# EAGLE design Link232-wifi-c64 (EAGLE 9.6.2)
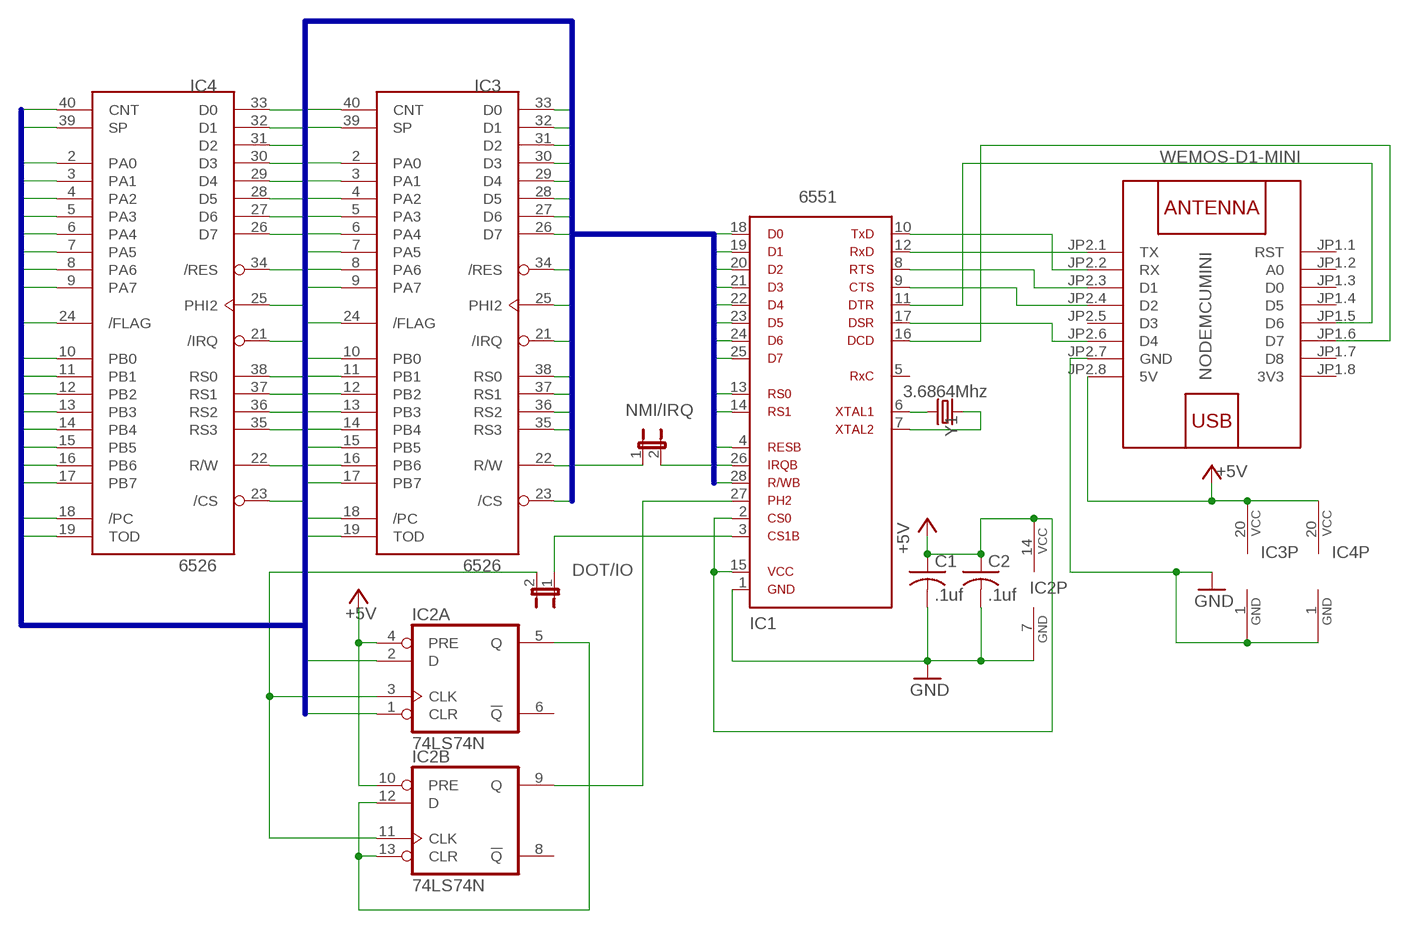
[diagram p0: schematic, sheet 1]

## Parts
C1  .1uf  C-US050-024X044  [C050-024X044]
C2  .1uf  C-US050-024X044  [C050-024X044]
IC1  6551  [6551]
IC2  74LS74N  [DIL14]
IC3  6526  [DIP40]
IC4  6526  [DIP40]
JP1  NMI/IRQ  JP1E  [JP1]
JP2  DOT/IO  JP1E  [JP1]
NODEMCUMINI  WEMOS-D1-MINI  [WEMOS-D1-MINI]
Y1  3.6864Mhz  CRYSTALPTH-HC49US  [HC49US]

## Nets
+5V: C1.1 C2.1 IC1.2 IC1.15 IC2.4(A:PRE) IC2.10(B:PRE) IC2.14(P:VCC) IC3.20(VCC) IC4.20(VCC) NODEMCUMINI.JP2.8(5V)
/CS: IC3.23(/CS) IC4.23(/CS)
/FLAG: IC3.24(/FLAG) IC4.24(/FLAG)
/PC: IC3.18(/PC) IC4.18(/PC)
CNT: IC3.40(CNT) IC4.40(CNT)
D0: IC1.18 IC3.33(D0) IC4.33(D0)
D1: IC1.19 IC3.32(D1) IC4.32(D1)
D2: IC1.20 IC3.31(D2) IC4.31(D2)
D3: IC1.21 IC3.30(D3) IC4.30(D3)
D4: IC1.22 IC3.29(D4) IC4.29(D4)
D5: IC1.23 IC3.28(D5) IC4.28(D5)
D6: IC1.24 IC3.27(D6) IC4.27(D6)
D7: IC1.25 IC3.26(D7) IC4.26(D7)
GND: C1.2 C2.2 IC1.1 IC2.7(P:GND) IC3.1(GND) IC4.1(GND) NODEMCUMINI.JP2.7(GND)
IRQ: IC3.21(/IRQ) IC4.21(/IRQ) JP1.1
N$1: IC2.3(A:CLK) IC2.11(B:CLK) JP2.2
N$2: IC2.5(A:Q) IC2.12(B:D) IC2.13(B:CLR)
N$3: IC1.27 IC2.9(B:Q)
N$4: IC1.26 JP1.2
N$5: IC1.3 JP2.1
N$9: IC1.6 Y1.2
N$10: IC1.7 Y1.1
N$11: IC1.12 NODEMCUMINI.JP2.1(TX)
N$12: IC1.10 NODEMCUMINI.JP2.2(RX)
N$13: IC1.8 NODEMCUMINI.JP2.3(D1)
N$14: IC1.9 NODEMCUMINI.JP2.4(D2)
N$15: IC1.17 NODEMCUMINI.JP2.6(D4)
N$16: IC1.11 NODEMCUMINI.JP1.5(D6)
N$17: IC1.16 NODEMCUMINI.JP1.6(D7)
PA0: IC3.2(PA0) IC4.2(PA0)
PA1: IC3.3(PA1) IC4.3(PA1)
PA2: IC3.4(PA2) IC4.4(PA2)
PA3: IC3.5(PA3) IC4.5(PA3)
PA4: IC3.6(PA4) IC4.6(PA4)
PA5: IC3.7(PA5) IC4.7(PA5)
PA6: IC3.8(PA6) IC4.8(PA6)
PA7: IC3.9(PA7) IC4.9(PA7)
PB0: IC3.10(PB0) IC4.10(PB0)
PB1: IC3.11(PB1) IC4.11(PB1)
PB2: IC3.12(PB2) IC4.12(PB2)
PB3: IC3.13(PB3) IC4.13(PB3)
PB4: IC3.14(PB4) IC4.14(PB4)
PB5: IC3.15(PB5) IC4.15(PB5)
PB6: IC3.16(PB6) IC4.16(PB6)
PB7: IC3.17(PB7) IC4.17(PB7)
PHI2: IC2.1(A:CLR) IC2.2(A:D) IC3.25(PHI2) IC4.25(PHI2)
RES: IC1.4 IC3.34(/RES) IC4.34(/RES)
RS0: IC1.13 IC3.38(RS0) IC4.38(RS0)
RS1: IC1.14 IC3.37(RS1) IC4.37(RS1)
RS2: IC3.36(RS2) IC4.36(RS2)
RS3: IC3.35(RS3) IC4.35(RS3)
RW: IC1.28 IC3.22(R/W) IC4.22(R/W)
SP: IC3.39(SP) IC4.39(SP)
TOD: IC3.19(TOD) IC4.19(TOD)
Unconnected: IC1.5 IC2.6(A:!Q) IC2.8(B:!Q) NODEMCUMINI.JP1.1(RST) NODEMCUMINI.JP1.2(A0) NODEMCUMINI.JP1.3(D0) NODEMCUMINI.JP1.4(D5) NODEMCUMINI.JP1.7(D8) NODEMCUMINI.JP2.5(D3)

## Buses
CNT,/CS,D0,D1,D2,D3,D4,D5,D6,D7,/FLAG,IRQ,PA0,PA1,PA2,PA3,PA4,PA5,PA6,PA7,PB0,PB1,PB2,PB3,PB4,PB5,PB6,PB7,/PC,PHI2,RES,RS0,RS1,RS2,RS3,RW,SP,TOD

## Power pins joined to a net without a drawn wire
3V3: NODEMCUMINI.JP1.8(3V3)

## Library data of the parts
C1 C2 = rcl:C-US: CAPACITOR, American symbol; SPICEPREFIX: C
IC1 = 65xx:6551: Dual In Line
IC2 = 74xx-us:74*74: Dual D type positive edge triggered FLIP FLOP, preset and clear
IC3 IC4 = 0RB_65xx:6526: I/O device: two 8-bits ports, handshake lines, timers. Used in C64 and C128.
JP1 JP2 = jumper:JP1E: JUMPER
NODEMCUMINI = diy-modules:WEMOS-D1-MINI: WEMOS D1 mini: Mini Wi-Fi Board based on ESP-8266 device More details can be found here: https://www.wemos.cc/product/d1-mini.html Click here to find device on ebay.com <http://www.ebay.com/sch/wemos+d1+mini+nodemcu>
Y1 = SparkFun-Clocks:CRYSTAL: Crystals (Generic) These are passive quartz crystals, which can be used as a clock source for a microcontroller. Crystal's are two-terminal devices. They require external "load" capacitors to generate an oscillating signal.

## Board
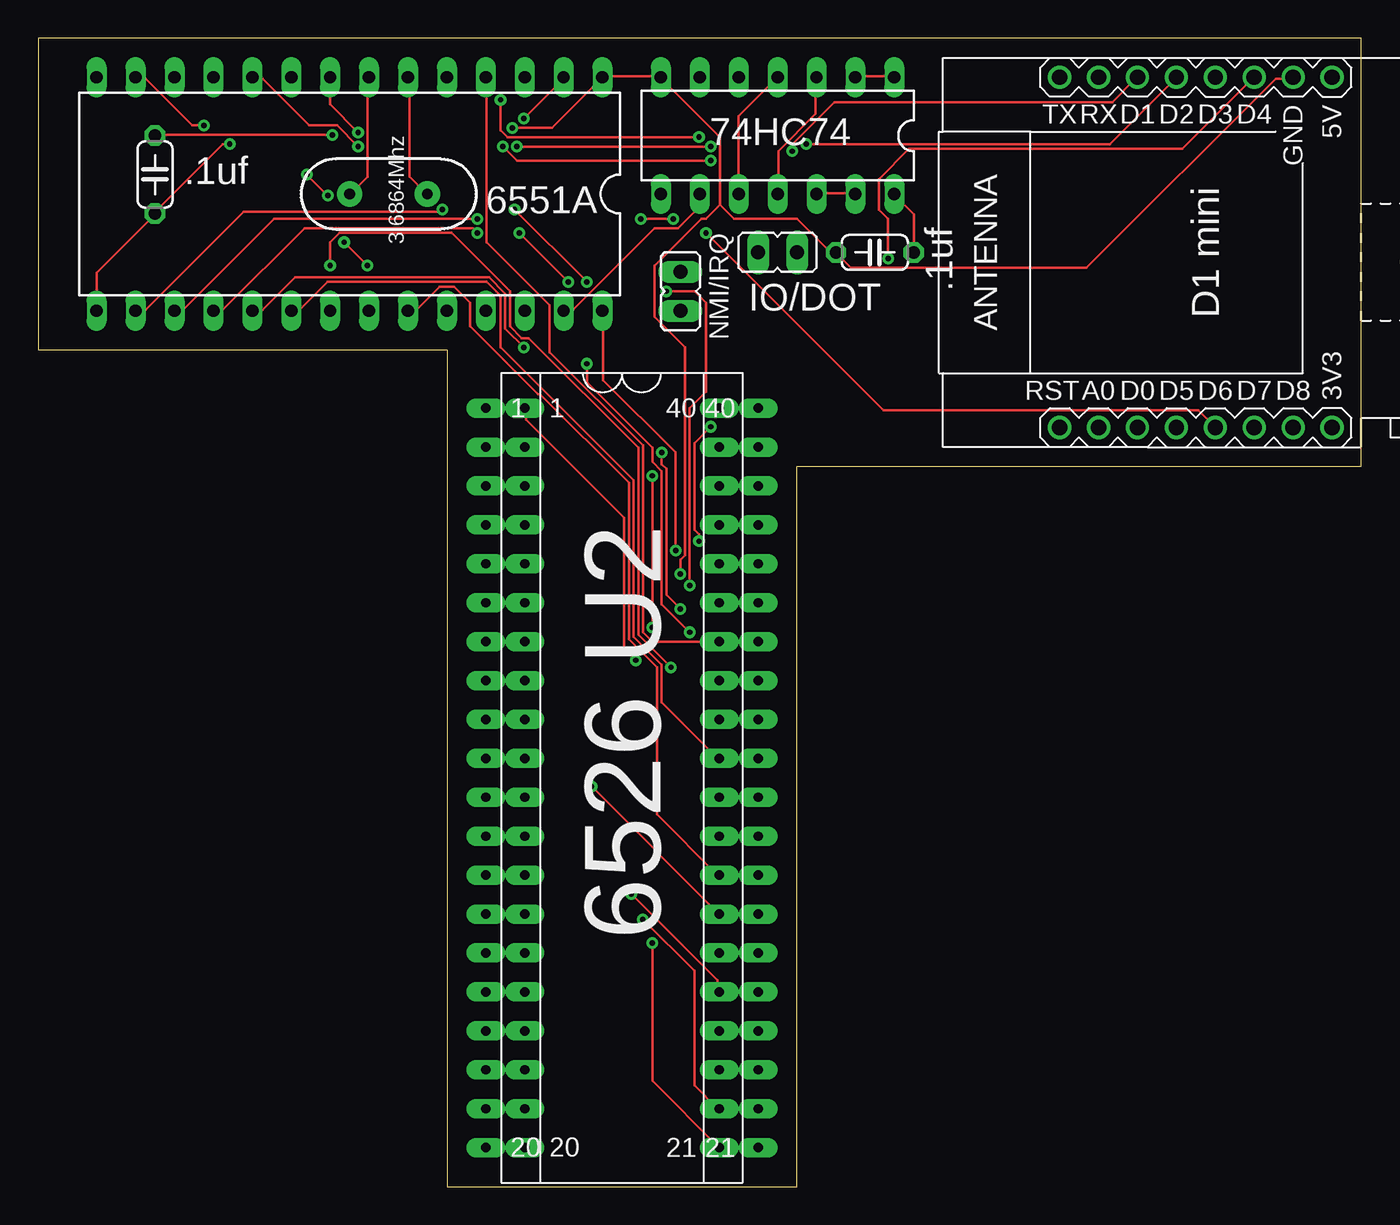
[diagram p1: board, top side]
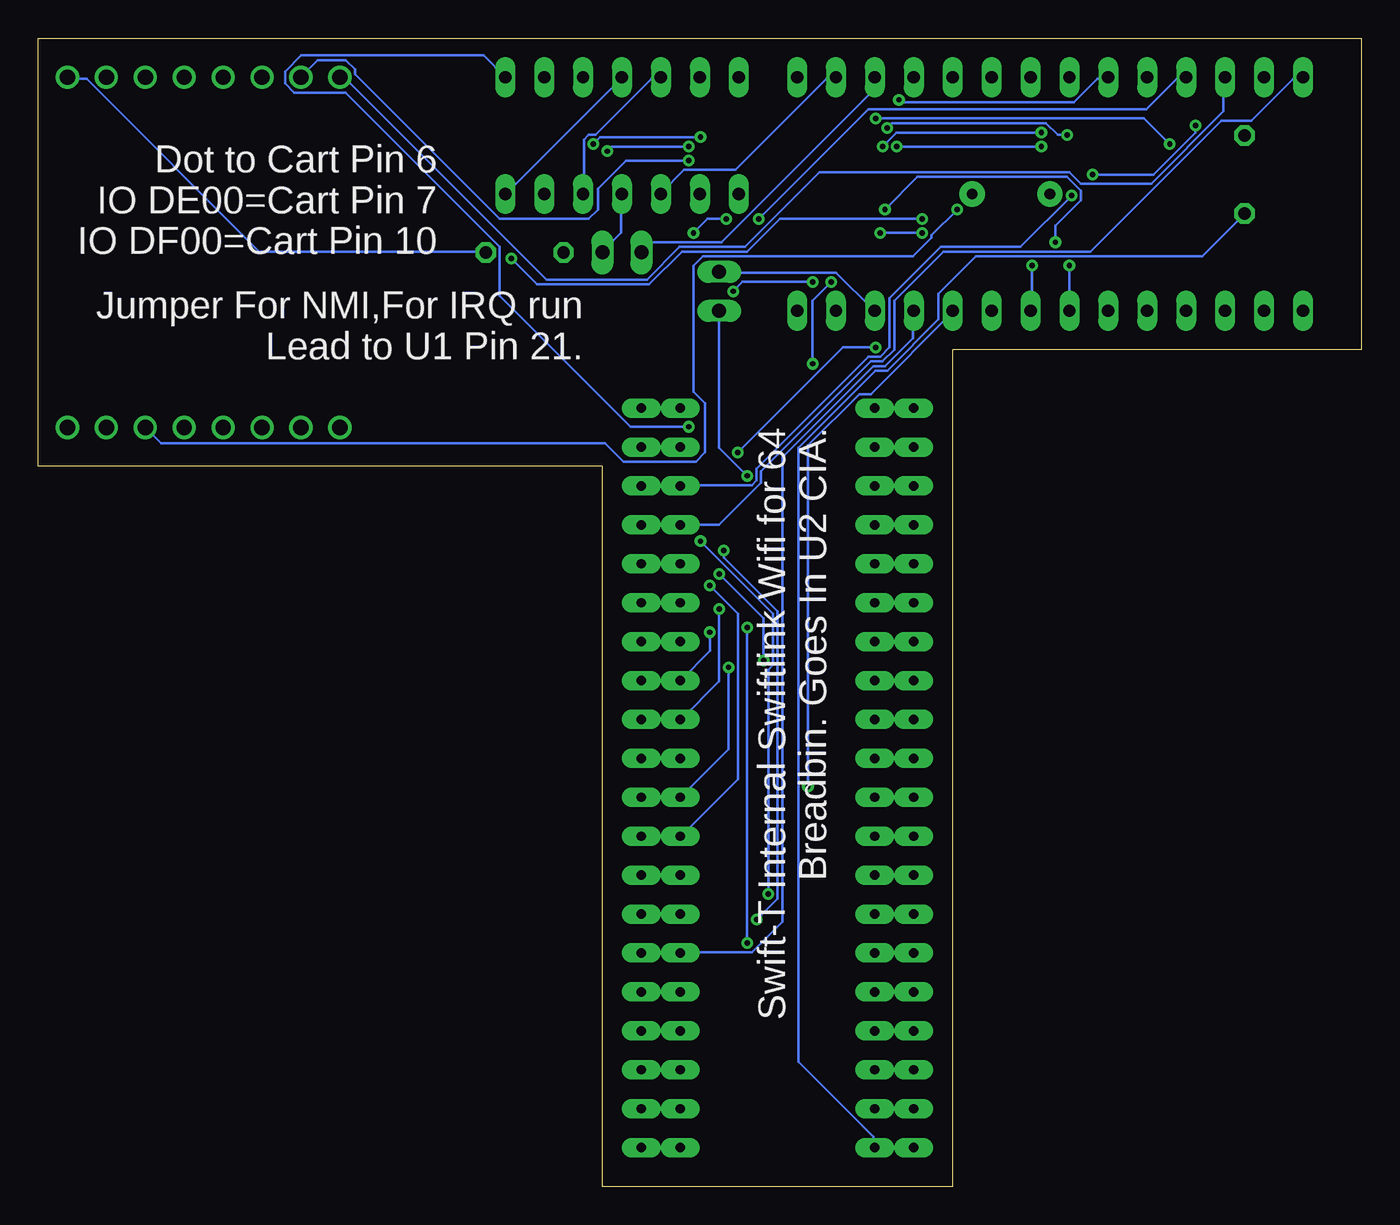
[diagram p2: board, bottom side, seen from below]

Size 86.36 x 74.93 mm. Coordinates in mm from the lower left corner, seen from the top.
Outline: 26.67,0 49.53,0 49.53,46.99 86.36,46.99 86.36,74.93 0,74.93 0,54.61 26.67,54.61 26.67,0
Copper layers (1*16): Top 0.035mm / dielectric 1.5mm / Bottom 0.035mm
Design rules "default": minimum track width 6mil, minimum drill 0.35mm, track to track 6mil, track to pad 6mil, pad to pad 6mil, via to via 6mil, smd to smd 6mil, copper to edge 40mil, drill to drill 6mil, minimum pad ring 10mil, minimum via ring 8mil, stop-mask expansion 4mil, vias tented up to drill 0mil, thermal gap 10mil

### Footprints (pad centres in the part's own frame; a part is rotated, then mirrored left to right if it is on the bottom)
C050-024X044 = drill 0.813 octagon: 1 -2.54,0; 2 2.54,0
6551 = drill 0.813 long: 1 -16.51,-7.62; 2 -13.97,-7.62; 3 -11.43,-7.62; 4 -8.89,-7.62; 5 -6.35,-7.62; 6 -3.81,-7.62; 7 -1.27,-7.62; 8 1.27,-7.62; 9 3.81,-7.62; 10 6.35,-7.62; 11 8.89,-7.62; 12 11.43,-7.62; 13 13.97,-7.62; 14 16.51,-7.62; 15 16.51,7.62; 16 13.97,7.62; 17 11.43,7.62; 18 8.89,7.62; 19 6.35,7.62; 20 3.81,7.62; 21 1.27,7.62; 22 -1.27,7.62; 23 -3.81,7.62; 24 -6.35,7.62; 25 -8.89,7.62; 26 -11.43,7.62; 27 -13.97,7.62; 28 -16.51,7.62
DIL14 = drill 0.813 long: 1 -7.62,-3.81; 2 -5.08,-3.81; 3 -2.54,-3.81; 4 0,-3.81; 5 2.54,-3.81; 6 5.08,-3.81; 7 7.62,-3.81; 8 7.62,3.81; 9 5.08,3.81; 10 2.54,3.81; 11 0,3.81; 12 -2.54,3.81; 13 -5.08,3.81; 14 -7.62,3.81
DIP40 = drill 0.61 pad 1.27 long: 1 -24.13,-7.62; 2 -21.59,-7.62; 3 -19.05,-7.62; 4 -16.51,-7.62; 5 -13.97,-7.62; 6 -11.43,-7.62; 7 -8.89,-7.62; 8 -6.35,-7.62; 9 -3.81,-7.62; 10 -1.27,-7.62; 11 1.27,-7.62; 12 3.81,-7.62; 13 6.35,-7.62; 14 8.89,-7.62; 15 11.43,-7.62; 16 13.97,-7.62; 17 16.51,-7.62; 18 19.05,-7.62; 19 21.59,-7.62; 20 24.13,-7.62; 21 24.13,7.62; 22 21.59,7.62; 23 19.05,7.62; 24 16.51,7.62; 25 13.97,7.62; 26 11.43,7.62; 27 8.89,7.62; 28 6.35,7.62; 29 3.81,7.62; 30 1.27,7.62; 31 -1.27,7.62; 32 -3.81,7.62; 33 -6.35,7.62; 34 -8.89,7.62; 35 -11.43,7.62; 36 -13.97,7.62; 37 -16.51,7.62; 38 -19.05,7.62; 39 -21.59,7.62; 40 -24.13,7.62
JP1 = drill 0.914 long: 1 0,-1.27; 2 0,1.27
WEMOS-D1-MINI = drill 1: JP1.1 -11.43,9.525; JP1.2 -11.43,6.985; JP1.3 -11.43,4.445; JP1.4 -11.43,1.905; JP1.5 -11.43,-0.635; JP1.6 -11.43,-3.175; JP1.7 -11.43,-5.715; JP1.8 -11.43,-8.255; JP2.1 11.43,9.525; JP2.2 11.43,6.985; JP2.3 11.43,4.445; JP2.4 11.43,1.905; JP2.5 11.43,-0.635; JP2.6 11.43,-3.175; JP2.7 11.43,-5.715; JP2.8 11.43,-8.255
HC49US = drill 0.7 pad 1.651: 1 -2.54,0; 2 2.54,0

### Placement (x,y rotation side)
C1  54.61,60.96 180 top
C2  7.62,66.04 90 top
IC1  20.32,64.77 180 top
IC2  48.26,68.58 180 top
IC3  36.83,26.67 270 top
IC4  39.37,26.67 270 top
JP1  41.91,58.42 0 top
JP2  48.26,60.96 270 top
NODEMCUMINI  76.2,60.96 90 top
Y1  22.86,64.77 0 top

### Tracks (layer width: path | path; a pad name or v marks a point on that pad's centre or on a via)
+5V  (via drill 0.35)
  Top 0.152: IC2.10 45.72,69.85 IC2.4 | C1.1 57.15,63.45 55.93,64.67 IC2.14 | IC3.20 29.26,2.49 31.7,2.49 IC4.20 | IC1.15 3.81,59.64 7.62,63.45 C2.1 7.62,63.6 12.04,68.02 v12.5,68.02 | v31.7,69.7 34.29,72.29 IC1.2
  Bottom 0.152: IC1.2 34.29,72.29 34.9,72.29 40.84,66.34 44.2,66.34 45.72,64.82 IC2.10 | NODEMCUMINI.JP2.8 84.43,72.29 83.21,72.29 71.93,61.01 57.15,61.01 C1.1 | IC2.4 48.31,72.29 55.78,64.82 IC2.14 | IC4.20 31.85,2.64 31.85,3.25 36.73,8.13 36.73,48.21 31.7,53.24 30.94,53.24 27.58,56.59 27.58,58.27 25.15,60.71 10.36,60.71 7.62,63.45 C2.1 | v31.7,69.7 14.17,69.7 v12.5,68.02
/CS
  Top 0.152: IC3.23 44.5,7.67 46.94,7.67 IC4.23
/FLAG
  Top 0.152: IC3.24 44.5,10.11 46.94,10.11 IC4.24
/PC
  Top 0.152: IC3.18 29.26,7.67 31.7,7.67 IC4.18
CNT
  Top 0.152: IC4.40 IC3.40
D0  (via drill 0.35)
  Top 0.152: IC3.33 44.5,32.97 46.94,32.97 IC4.33 | v28.65,62.23 28.35,62.54 17.37,62.54 12.04,57.2 11.43,57.2 IC1.18 | v34.59,59.03 v31.39,62.23 | v35.81,53.7 35.81,52.48 40.08,48.21 40.08,47.3 40.69,46.69 40.69,38 v42.52,36.17
  Bottom 0.152: v31.39,62.23 v28.65,62.23 | v34.59,59.03 35.81,57.81 v35.81,53.7 | v42.52,36.17 42.52,34.95 IC3.33
D1  (via drill 0.35)
  Top 0.152: IC3.32 44.5,30.53 46.94,30.53 IC4.32 | v31.7,54.76 30.48,55.98 30.48,58.27 29.41,59.33 16.76,59.33 14.63,57.2 14.02,57.2 IC1.19 | v40.69,47.9 40.69,47.14 41,46.84 41,38.61 v41.91,37.69
  Bottom 0.152: v31.7,54.76 33.83,54.76 v40.69,47.9 | v41.91,37.69 41.91,32.97 44.35,30.53 IC3.32
D2
  Top 0.152: IC4.31 IC3.31 44.35,27.94 40.69,31.6 40.69,34.04 38.86,35.87 38.86,46.08 30.17,54.76 30.17,58.12 29.26,59.03 18.9,59.03 17.07,57.2 16.61,57.2 IC1.20
D3  (via drill 0.35)
  Top 0.152: IC3.30 44.5,25.35 46.94,25.35 IC4.30 | v19.05,60.1 19.05,61.62 19.66,62.23 26.98,62.23 30.79,58.42 30.79,56.13 31.55,55.37 32,55.37 39.17,48.21 39.17,36.02 v41.3,33.88
  Bottom 0.152: v19.05,60.1 IC1.21 | v41.3,33.88 41.3,28.55 IC3.30
D4  (via drill 0.35)
  Top 0.152: IC3.29 44.5,22.91 46.94,22.91 IC4.29 | v19.96,61.62 v21.49,60.1 | v35.81,59.03 v31.09,63.75 | v41,58.42 42.82,58.42 43.59,57.66 43.59,51.87 42.52,50.8 v42.52,39.22
  Bottom 0.152: v21.49,60.1 21.49,57.2 IC1.22 | v19.96,61.62 19.96,62.69 18.29,64.36 18.29,64.97 19.2,65.89 28.96,65.89 v31.09,63.75 | v35.81,59.03 40.39,59.03 v41,58.42 | v42.52,39.22 40.69,37.39 40.69,26.57 44.35,22.91 IC3.29
D5
  Top 0.152: IC4.28 IC3.28 44.35,20.32 40.39,24.28 40.39,33.88 38.56,35.71 38.56,45.92 32.77,51.71 32.61,51.71 28.19,56.13 28.19,57.66 27.13,58.73 26.21,58.73 24.69,57.2 24.23,57.2 IC1.23
D6  (via drill 0.35)
  Top 0.152: IC4.27 46.94,17.73 44.5,17.73 IC3.27 v36.12,26.11
  Bottom 0.152: v36.12,26.11 36.12,48.36 32.77,51.71 32,51.71 26.67,57.05 IC1.24
D7
  Top 0.152: IC3.26 44.5,15.29 46.94,15.29 IC4.26
  Bottom 0.152: IC1.25 29.26,57.05 29.26,55.37 31.09,53.54 31.85,53.54 37.8,47.6 37.8,17.27 39.78,15.29 44.35,15.29 IC3.26
GND  (via drill 0.35)
  Top 0.152: IC3.1 IC4.1 31.85,50.8 31.85,50.04 38.25,43.64 38.25,35.1 v39.01,34.34 | v19.2,68.63 7.62,68.63 C2.2 | v30.94,69.09 33.53,69.09 IC1.1 36.88,72.44 40.54,72.44 IC2.7 40.69,72.29 44.5,68.48 44.5,64.06 | 44.5,64.06 45.41,63.14 49.53,63.14 51.66,61.01 51.97,61.01 C1.2 52.12,60.86 53.04,59.94 68.43,59.94 80.77,72.29 81.84,72.29 NODEMCUMINI.JP2.7 | v41.91,39.98 41.91,40.89 42.22,41.2 42.22,54.76 40.23,56.74 40.23,60.1 43.28,63.14 43.59,63.14 44.5,64.06
  Bottom 0.152: v19.2,68.63 19.81,68.63 20.57,69.39 30.63,69.39 v30.94,69.09 | v39.01,34.34 39.01,37.08 v41.91,39.98
IRQ  (via drill 0.35)
  Top 0.152: IC4.21 46.94,2.49 44.5,2.49 IC3.21 40.08,6.91 v40.08,15.9 | v40.08,36.47 v40.08,46.38
  Bottom 0.152: JP1.1 41.91,48.21 v40.08,46.38 | v40.08,15.9 v40.08,36.47
N$1
  Top 0.152: IC2.3 50.75,72.29 50.75,70 48.31,67.56 48.31,64.82 IC2.11
  Bottom 0.152: IC2.11 48.31,64.67 48.31,62.23 49.53,61.01 JP2.2
N$2
  Top 0.152: IC2.12 50.9,64.82 53.34,64.82 IC2.13
  Bottom 0.152: IC2.5 45.72,72.29 46.33,72.29 49.99,68.63 50.44,68.63 50.75,68.33 50.75,64.82 IC2.12
N$3
  Top 0.152: IC1.27 34.29,57.2 34.9,57.2 40.23,62.54 41.76,62.54 43.13,63.91 43.13,64.67 IC2.9
N$4
  Bottom 0.152: IC1.26 31.85,57.2 34.29,59.64 41.91,59.64 JP1.2
N$5
  Bottom 0.152: JP2.1 46.33,61.62 41.76,61.62 31.85,71.53 31.85,72.29 IC1.3
N$9
  Top 0.152: IC1.6 24.23,72.29 24.23,65.89 25.3,64.82 Y1.2
N$10
  Top 0.152: IC1.7 21.49,72.29 21.49,65.89 20.42,64.82 Y1.1
N$11
  Bottom 0.152: IC1.12 8.99,72.29 8.99,70.16 13.72,65.43 18.29,65.43 19.05,66.19 35.36,66.19 40.23,61.32 44.5,61.32 46.63,59.18 53.19,59.18 66.29,72.29 66.6,72.29 NODEMCUMINI.JP2.1
N$12  (via drill 0.35)
  Top 0.152: v20.88,67.87 19.51,69.24 17.68,69.24 14.63,72.29 14.02,72.29 IC1.10 | v30.33,67.87 31.24,66.95 v43.89,66.95
  Bottom 0.152: v30.33,67.87 v20.88,67.87 | v43.89,66.95 48.01,66.95 49.84,65.13 49.84,63.75 50.44,63.14 56.24,63.14 65.68,72.59 65.68,72.9 66.29,73.51 68.12,73.51 69.19,72.44 NODEMCUMINI.JP2.2
N$13  (via drill 0.35)
  Top 0.152: IC1.8 19.05,70.61 v20.88,68.78 | v43.89,67.87 v31.24,67.87 | v49.23,67.56 49.23,68.02 51.97,70.76 70.1,70.76 71.63,72.29 NODEMCUMINI.JP2.3
  Bottom 0.152: v20.88,68.78 30.33,68.78 v31.24,67.87 | v43.89,67.87 48.92,67.87 v49.23,67.56
N$14  (via drill 0.35)
  Top 0.152: v30.17,70.92 30.17,68.94 30.63,68.48 v43.13,68.48 | v50.14,68.02 69.95,68.02 74.22,72.29 NODEMCUMINI.JP2.4
  Bottom 0.152: v30.17,70.92 30.02,70.76 18.75,70.76 17.22,72.29 16.61,72.29 IC1.9 | v43.13,68.48 49.68,68.48 v50.14,68.02
N$15  (via drill 0.35)
  Top 0.152: v28.65,63.14 15.39,63.14 9.45,57.2 8.99,57.2 IC1.17 | v55.47,60.55 55.47,63.14 54.86,63.75 54.86,65.73 56.85,67.72 74.68,67.72 79.25,72.29 NODEMCUMINI.JP2.6
  Bottom 0.152: v28.65,63.14 37.95,63.14 40.08,61.01 44.35,61.01 46.48,58.88 53.8,58.88 v55.47,60.55
N$16  (via drill 0.35)
  Top 0.152: v41.45,63.14 v39.32,63.14 | v43.59,62.23 55.17,50.65 75.74,50.65 76.81,49.58 NODEMCUMINI.JP1.5
  Bottom 0.152: v39.32,63.14 32.16,70.31 14.02,70.31 12.04,72.29 11.43,72.29 IC1.11 | v41.45,63.14 42.67,63.14 v43.59,62.23
N$17  (via drill 0.35)
  Top 0.152: v26.37,63.75 26.21,63.6 13.41,63.6 7.01,57.2 6.4,57.2 IC1.16
  Bottom 0.152: v26.37,63.75 28.04,62.08 28.04,61.93 29.26,60.71 42.98,60.71 43.59,60.1 43.59,51.87 42.82,51.11 42.82,47.9 43.43,47.3 48.16,47.3 49.38,48.51 78.33,48.51 79.25,49.43 NODEMCUMINI.JP1.6
PA0
  Top 0.152: IC3.2 29.26,48.21 31.7,48.21 IC4.2
PA1
  Top 0.152: IC3.3 29.26,45.77 31.7,45.77 IC4.3
PA2
  Top 0.152: IC4.4 IC3.4
PA3
  Top 0.152: IC3.5 29.26,40.59 31.7,40.59 IC4.5
PA4
  Top 0.152: IC3.6 29.26,38.15 31.7,38.15 IC4.6
PA5
  Top 0.152: IC4.7 IC3.7
PA6
  Top 0.152: IC3.8 29.26,32.97 31.7,32.97 IC4.8
PA7
  Top 0.152: IC3.9 29.26,30.53 31.7,30.53 IC4.9
PB0
  Top 0.152: IC4.10 IC3.10
PB1
  Top 0.152: IC3.11 29.26,25.35 31.7,25.35 IC4.11
PB2
  Top 0.152: IC3.12 29.26,22.91 31.7,22.91 IC4.12
PB3
  Top 0.152: IC4.13 IC3.13
PB4
  Top 0.152: IC3.14 29.26,17.73 31.7,17.73 IC4.14
PB5
  Top 0.152: IC3.15 29.26,15.29 31.7,15.29 IC4.15
PB6
  Top 0.152: IC4.16 IC3.16
PB7
  Top 0.152: IC3.17 29.26,10.11 31.7,10.11 IC4.17
PHI2  (via drill 0.35)
  Top 0.152: IC4.25 IC3.25 44.35,12.7 44.35,13.46 v38.71,19.1 | IC2.2 53.34,72.44 55.78,72.44 IC2.1 | v43.13,42.11 43.13,42.57 42.82,42.88 42.82,48.51 v43.89,49.58
  Bottom 0.152: v38.71,19.1 38.71,33.73 38.41,34.04 38.41,37.39 v43.13,42.11 | v43.89,49.58 47.7,49.58 56.24,58.12 56.24,61.32 66.29,71.37 69.65,71.37 70.26,71.98 70.26,72.75 69.19,73.81 57.3,73.81 IC2.1
RES
  Top 0.152: IC4.34 IC3.34 40.08,35.56 39.47,36.17 39.47,48.36 33.38,54.46 33.38,57.51 29.26,61.62 29.26,72.29 IC1.4
RS0  (via drill 0.35)
  Top 0.152: IC3.38 44.5,45.77 46.94,45.77 IC4.38 | v10.82,69.24 10.06,69.24 7.01,72.29 6.4,72.29 IC1.13 | v18.9,64.67 v17.53,66.04
  Bottom 0.152: v10.82,69.24 10.82,68.78 13.56,66.04 v17.53,66.04 | v18.9,64.67 22.25,61.32 27.43,61.32 30.79,57.96 30.79,54.76 31.39,54.15 32.16,54.15 39.47,46.84 39.47,46.08 39.78,45.77 44.35,45.77 IC3.38
RS1
  Top 0.152: IC4.37 IC3.37
  Bottom 0.152: IC3.37 41.91,43.18 39.17,45.92 39.17,46.69 32,53.85 31.24,53.85 30.48,54.61 30.48,57.81 27.28,61.01 17.68,61.01 9.14,69.55 7.16,69.55 4.42,72.29 3.81,72.29 IC1.14
RS2
  Top 0.152: IC3.36 44.5,40.59 46.94,40.59 IC4.36
RS3
  Top 0.152: IC3.35 44.5,38.15 46.94,38.15 IC4.35
RW  (via drill 0.35)
  Top 0.152: IC4.22 IC3.22 44.35,5.08 42.82,6.6 42.82,14.07 v39.47,17.42 | v41.6,41.5 41.6,47.9 36.88,52.63 36.88,57.05 IC1.28
  Bottom 0.152: v41.6,41.5 41.6,41.05 38.1,37.54 38.1,18.8 v39.47,17.42
SP
  Top 0.152: IC3.39 44.5,48.21 46.94,48.21 IC4.39
TOD
  Top 0.152: IC4.19 IC3.19

### Text on the board
tPlace: 3.6864Mhz | 74HC74 | .1uf | 6551A | .1uf | IO/DOT | NMI/IRQ | 6526 U2
bPlace: Dot to Cart Pin 6 / IO DE00=Cart Pin 7 / IO DF00=Cart Pin 10 | Jumper For NMI,For IRQ run / Lead to U1 Pin 21. | Swift-T Internal Swiftlink Wifi for 64 / Breadbin. Goes In U2 CIA.